# Altium schematic sheet GPIO.SchDoc: GPIO
size A3; Author: Vi Tín; SheetNumber: 13; SheetTotal: 15
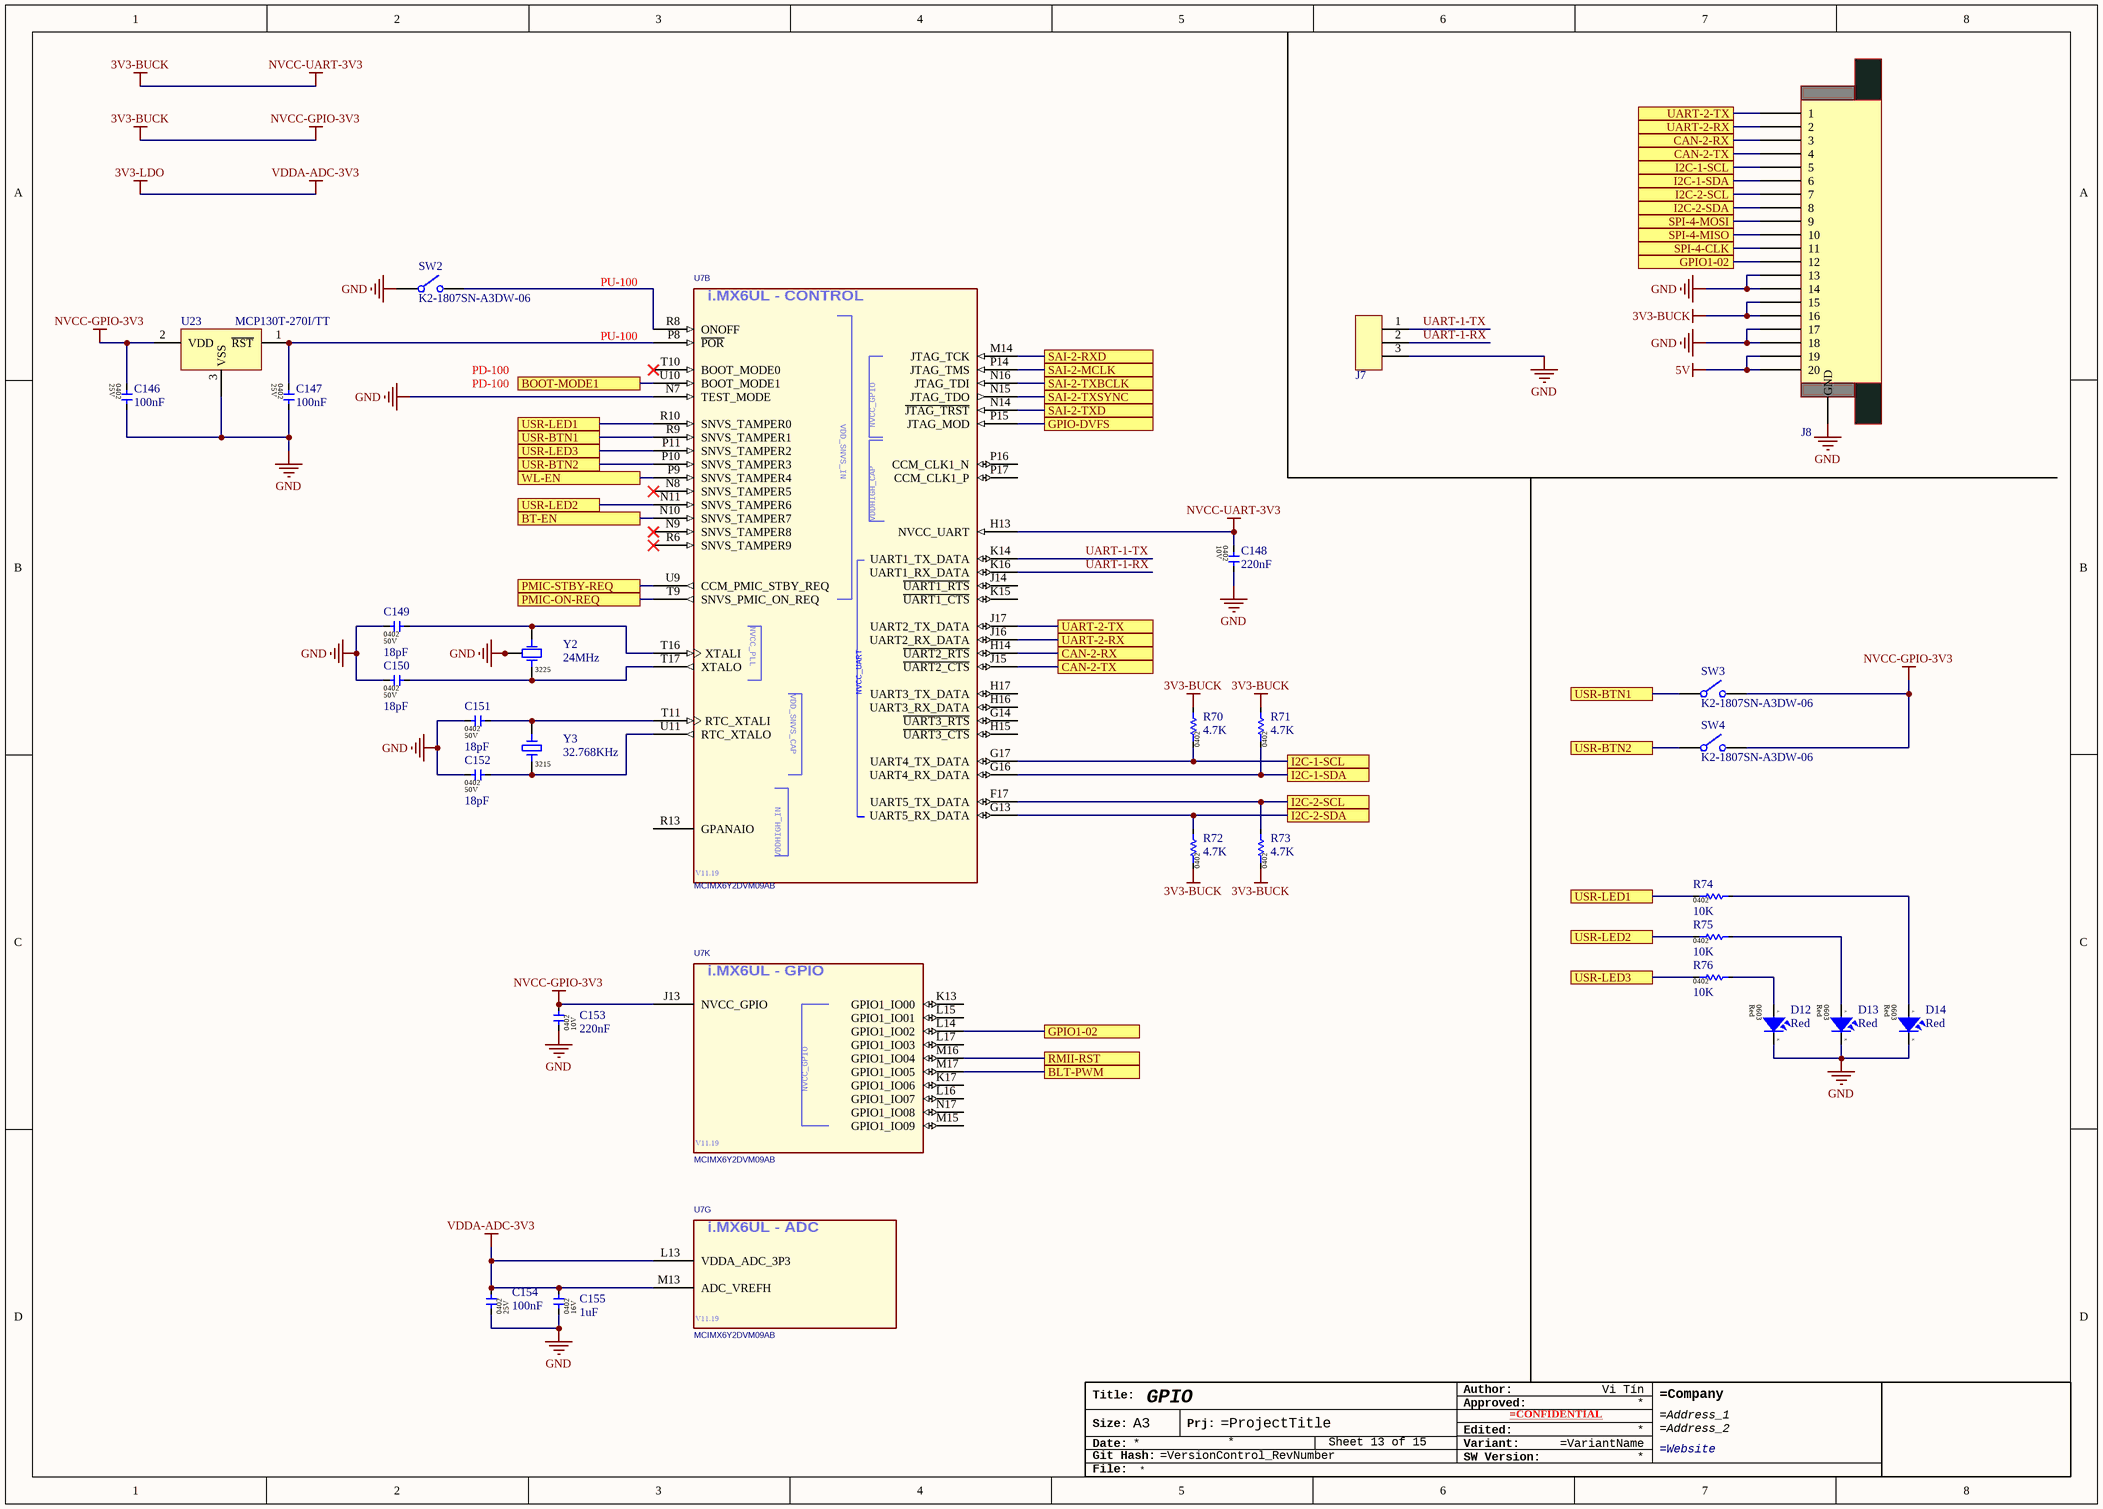
[diagram p0: GPIO.SchDoc]

## Parts
*?  TitleBlock_Generic  (value not drawn)  (graphical)
C146  100nF  [CAP-0402]
C147  100nF  [CAP-0402]
C148  220nF  [CAP-0402]
C149  18pF  [CAP-0402]
C150  18pF  [CAP-0402]
C151  18pF  [CAP-0402]
C152  18pF  [CAP-0402]
C153  220nF  [CAP-0402]
C154  100nF  [CAP-0402]
C155  1uF  [CAP-0402]
D12  Red  [LED-0603 RED]
D13  Red  [LED-0603 RED]
D14  Red  [LED-0603 RED]
J7  PZ254V-11-03P  [Conn 3P-2.54H]  (value not drawn)
J8  AFC07-S20ECC-00  [FPC - 20P, 0.5mm, top]  (value not drawn)
R70  4.7K  [RES-0402]
R71  4.7K  [RES-0402]
R72  4.7K  [RES-0402]
R73  4.7K  [RES-0402]
R74  10K  [RES-0402]
R75  10K  [RES-0402]
R76  10K  [RES-0402]
SW2  K2-1807SN-A3DW-06  [SW - TYPE 3]
SW3  K2-1807SN-A3DW-06  [SW - TYPE 3]
SW4  K2-1807SN-A3DW-06  [SW - TYPE 3]
U7  MCIMX6Y2DVM09AB  [IMX6ULL]  (parts B,G,K of 11)
U23  MCP130T-270I/TT  [SOT23-3]
Y2  24MHz  [Crystal-3225]
Y3  32.768KHz  [Crystal-3215]

## Ports
BLT-PWM, BOOT-MODE1, BT-EN, CAN-2-RX, CAN-2-TX, GPIO1-02, GPIO-DVFS, I2C-1-SCL, I2C-1-SDA, I2C-2-SCL, I2C-2-SDA, PMIC-ON-REQ, PMIC-STBY-REQ, RMII-RST, SAI-2-MCLK, SAI-2-RXD, SAI-2-TXBCLK, SAI-2-TXD, SAI-2-TXSYNC, SPI-4-CLK, SPI-4-MISO, SPI-4-MOSI, UART-2-RX, UART-2-TX, USR-BTN1, USR-BTN2, USR-LED1, USR-LED2, USR-LED3, WL-EN

## Nets
3V3-BUCK: C146.1 C148.1 C153.2 J8.15 J8.16 R70.2 R71.2 R72.1 R73.1 SW3.2 SW4.2 U7.H13(NVCC_UART) U7.J13(NVCC_GPIO) U23.2(VDD)  [also labelled NVCC-GPIO-3V3, NVCC-UART-3V3]
3V3-LDO: C154.2 C155.2 U7.L13(VDDA_ADC_3P3) U7.M13(ADC_VREFH)  [also labelled VDDA-ADC-3V3]
5V: J8.19 J8.20
GND: C146.2 C147.2 C148.2 C149.1 C150.1 C151.1 C152.1 C153.1 C154.1 C155.1 D12.1(Cathode) D13.1(Cathode) D14.1(Cathode) J7.3 J8.0(GND) J8.13 J8.14 J8.17 J8.18 SW2.1 U7.N7(TEST_MODE) U23.3(VSS) Y2.2(GND) Y2.4(GND)
BLT-PWM: U7.M17(GPIO1_IO05) ; port BLT-PWM
BOOT-MODE1: U7.U10(BOOT_MODE1) ; port BOOT-MODE1
BT-EN: U7.N10(SNVS_TAMPER7) ; port BT-EN
CAN-2-RX: J8.3 U7.H14(~{UART2_RTS}) ; port CAN-2-RX
CAN-2-TX: J8.4 U7.J15(~{UART2_CTS}) ; port CAN-2-TX
GPIO1-02: J8.12 U7.L14(GPIO1_IO02) ; port GPIO1-02
GPIO-DVFS: U7.P15(JTAG_MOD) ; port GPIO-DVFS
I2C-1-SCL: J8.5 R70.1 U7.G17(UART4_TX_DATA) ; port I2C-1-SCL
I2C-1-SDA: J8.6 R71.1 U7.G16(UART4_RX_DATA) ; port I2C-1-SDA
I2C-2-SCL: J8.7 R73.2 U7.F17(UART5_TX_DATA) ; port I2C-2-SCL
I2C-2-SDA: J8.8 R72.2 U7.G13(UART5_RX_DATA) ; port I2C-2-SDA
PMIC-ON-REQ: U7.T9(SNVS_PMIC_ON_REQ) ; port PMIC-ON-REQ
PMIC-STBY-REQ: U7.U9(CCM_PMIC_STBY_REQ) ; port PMIC-STBY-REQ
RMII-RST: U7.M16(GPIO1_IO04) ; port RMII-RST
SAI-2-MCLK: U7.P14(JTAG_TMS) ; port SAI-2-MCLK
SAI-2-RXD: U7.M14(JTAG_TCK) ; port SAI-2-RXD
SAI-2-TXBCLK: U7.N16(JTAG_TDI) ; port SAI-2-TXBCLK
SAI-2-TXD: U7.N14(~{JTAG_TRST}) ; port SAI-2-TXD
SAI-2-TXSYNC: U7.N15(JTAG_TDO) ; port SAI-2-TXSYNC
SPI-4-CLK: J8.11 ; port SPI-4-CLK
SPI-4-MISO: J8.10 ; port SPI-4-MISO
SPI-4-MOSI: J8.9 ; port SPI-4-MOSI
UART-1-RX: J7.2 U7.K16(UART1_RX_DATA)
UART-1-TX: J7.1 U7.K14(UART1_TX_DATA)
UART-2-RX: J8.2 U7.J16(UART2_RX_DATA) ; port UART-2-RX
UART-2-TX: J8.1 U7.J17(UART2_TX_DATA) ; port UART-2-TX
USR-BTN1: SW3.1 U7.R9(SNVS_TAMPER1) ; port USR-BTN1
USR-BTN2: SW4.1 U7.P10(SNVS_TAMPER3) ; port USR-BTN2
USR-LED1: R74.1 U7.R10(SNVS_TAMPER0) ; port USR-LED1
USR-LED2: R75.1 U7.N11(SNVS_TAMPER6) ; port USR-LED2
USR-LED3: R76.1 U7.P11(SNVS_TAMPER2) ; port USR-LED3
WL-EN: U7.P9(SNVS_TAMPER4) ; port WL-EN
NetC147_1: C147.1 U7.P8(~{POR}) U23.1(~{RST})
NetC149_2: C149.2 U7.T16(XTALI) Y2.1(X1)
NetC150_2: C150.2 U7.T17(XTALO) Y2.3(X2)
NetC151_2: C151.2 U7.T11(RTC_XTALI) Y3.1(X1)
NetC152_2: C152.2 U7.U11(RTC_XTALO) Y3.2(X2)
NetD12_2: D12.2(Anode) R76.2
NetD13_2: D13.2(Anode) R75.2
NetD14_2: D14.2(Anode) R74.2
NetSW2_2: SW2.2 U7.R8(ONOFF)

Not connected (* = marked no-connect by the designer): U7 G14(~{UART3_RTS}) H15(~{UART3_CTS}) H16(UART3_RX_DATA) H17(UART3_TX_DATA) J14(~{UART1_RTS}) K13(GPIO1_IO00) K15(~{UART1_CTS}) K17(GPIO1_IO06) L15(GPIO1_IO01) L16(GPIO1_IO07) L17(GPIO1_IO03) M15(GPIO1_IO09) N8(SNVS_TAMPER5)* N9(SNVS_TAMPER8)* N17(GPIO1_IO08) P16(CCM_CLK1_N) P17(CCM_CLK1_P) R6(SNVS_TAMPER9)* R13(GPANAIO) T10(BOOT_MODE0)*

## Notes on the sheet
- PU-100
- PD-100
- (in symbol 19-217/R6C-AL1M2VY/3T) A; K
- (in symbol MCIMX6Y2DVM09AB, part B) i.MX6UL - CONTROL; VDDHIGH_CAP; VDDHIGH_IN; V11.19
- (in symbol MCIMX6Y2DVM09AB, part G) i.MX6UL - ADC; V11.19
- (in symbol MCIMX6Y2DVM09AB, part K) i.MX6UL - GPIO; V11.19
- (in symbol TitleBlock_Generic) Author:; Title:; Approved:; Size:; A3; Prj:; Edited:; Date:; Variant:; SW Version:; Git Hash:; File:

## Library data of the parts
C146 C147 C154 = 0402X104K250CT: 100nF ±10% 25V X5R 0402 Multilayer Ceramic Capacitors MLCC - SMD/SMT RoHS; Manufacture: WALSIN; Package / Case: 0402; Component type: Capacitor; Manufacture part: 0402X104K250CT; Capacitor value: 100nF; Voltage: 25V; Package: 0402
C148 C153 = 0402X224J100CT: 220nF ±5% 10V X5R 0402 Multilayer Ceramic Capacitors MLCC - SMD/SMT RoHS; Manufacture: WALSIN; Package / Case: 0402; Component type: Capacitor; Manufacture part: 0402X224J100CT; Capacitor value: 220nF; Voltage: 10V; Package: 0402
C149-C152 = 0402N180J500CT: 18pF ±5% 50V NP0 0402 Multilayer Ceramic Capacitors MLCC - SMD/SMT RoHS; Manufacture: WALSIN; Package / Case: 0402; Component type: Capacitor; Manufacture part: 0402N180J500CT; Capacitor value: 18pF; Voltage: 50V; Package: 0402
C155 = 0402X105K160CT: 1uF ±10% 16V X5R 0402 Multilayer Ceramic Capacitors MLCC - SMD/SMT RoHS; Manufacture: WALSIN; Package / Case: 0402; Component type: Capacitor; Manufacture part: 0402X105K160CT; Capacitor value: 1uF; Voltage: 16V; Package: 0402
D12-D14 = 19-217/R6C-AL1M2VY/3T: Red 617.5~633.5nm 0603 Light Emitting Diodes (LED) RoHS; Manufacture: Everlight Elec; Package / Case: 0402; Component type: Led; Part reference: *; Manufacture part: 19-217/R6C-AL1M2VY/3T; Color: Red; Package: 0603
J7 = PZ254V-11-03P: Pin Header 3 1 Straight，180degrees 2.54mm Through Hole,P=2.54mm Pin Header & Female Header RoHS; Manufacture: XFCN; Manufacture part: PZ254V-11-03P; Type: Pin Header; Datasheet: https://datasheet.lcsc.com/lcsc/2003141409_XFCN-PZ254V-11-02P_C492401.pdf
J8 = AFC07-S20ECC-00: Contact,Top 20 0.020"（0.50mm） 0.079"（2.00mm） Slide Lock 20P FFC, FPC Connectors RoHS; Manufacture: JUSHUO; Manufacture part: AFC07-S20ECC-00; Type: FPC; Datasheet: https://datasheet.lcsc.com/lcsc/1811021328_JUSHUO-AFC07-S20ECC-00_C11090.pdf
R70-R73 = WR04X4701FTL: 4.7kΩ ±1% 1/16W ±100ppm/℃ 0402 Chip Resistor - Surface Mount RoHS; Manufacture: WALSIN; Package / Case: 0201; Component type: Resistor; Manufacture part: WR04X4701FTL; Resistor value: 4.7K; Package: 0402
R74-R76 = WR04X1002FTL: 10kΩ ±1% 1/16W ±100ppm/℃ 0402 Chip Resistor - Surface Mount RoHS; Manufacture: WALSIN; Package / Case: 0201; Component type: Resistor; Manufacture part: WR04X1002FTL; Resistor value: 10K; Package: 0402
SW2-SW4 = K2-1807SN-A3DW-06: SMD,3×4×2.0mm Tactile Switches RoHS; Manufacture: Korean Hroparts Elec; Manufacture part: K2-1807SN-A3DW-06; Type: Tactile Switches; Datasheet: https://datasheet.lcsc.com/lcsc/2008221234_XUNPU-TS-1088-AR02016_C720477.pdf
U7 = MCIMX6Y2DVM09AB: Microprocessors - MPU i.MX 32-bit MPU ARM -A7 900MHz, 0.8mm Pitch; Manufacture: NXP Semiconductors; CLASS: IC; CAD_APPROVED: Yes; PRE_APN: 330-76997; MFG_PN01: PCIMX6G3CVM05AA; MFG_NAME01: FREESCALE SEMICONDUCTOR; AGILE_PN: TMP-WF-23753; HEIGHT: 1.37 MM; ROHS: Yes; Manufacture part: MCIMX6Y2DVM09AB; Package: MAPBGA-289 (14x14); Datasheet: https://www.mouser.vn/datasheet/2/302/IMX6ULLCEC-1126331.pdf
U23 = MCP130T-270I/TT: Microcontroller Supervisory Circuit with Open Drain Output; Manufacture: Microchip Tech; Manufacture part: MCP130T-270I/TT; Package: SOT23-3; Datasheet: https://www.mouser.vn/datasheet/2/268/11184d-68220.pdf
Y2 = SX32Y024000BC1T: 24MHz ±10ppm 12pF 40Ω SMD-3225 Crystals RoHS; Manufacture: TKD; Manufacture part: SX32Y024000BC1T; Crystal value: 24MHz; Package: 3225
Y3 = SF32WK32768D31T002: 32.768KHz ±20ppm 12.5pF 70kΩ 3215 Crystals RoHS; Manufacture: TKD; Manufacture part: SF32WK32768D31T002; Crystal value: 32.768KHz; Package: 3215
*? = TitleBlock_Generic: Manufacture part: TitleBlock_Generic; Manufacture: N/A; Type: Graphic